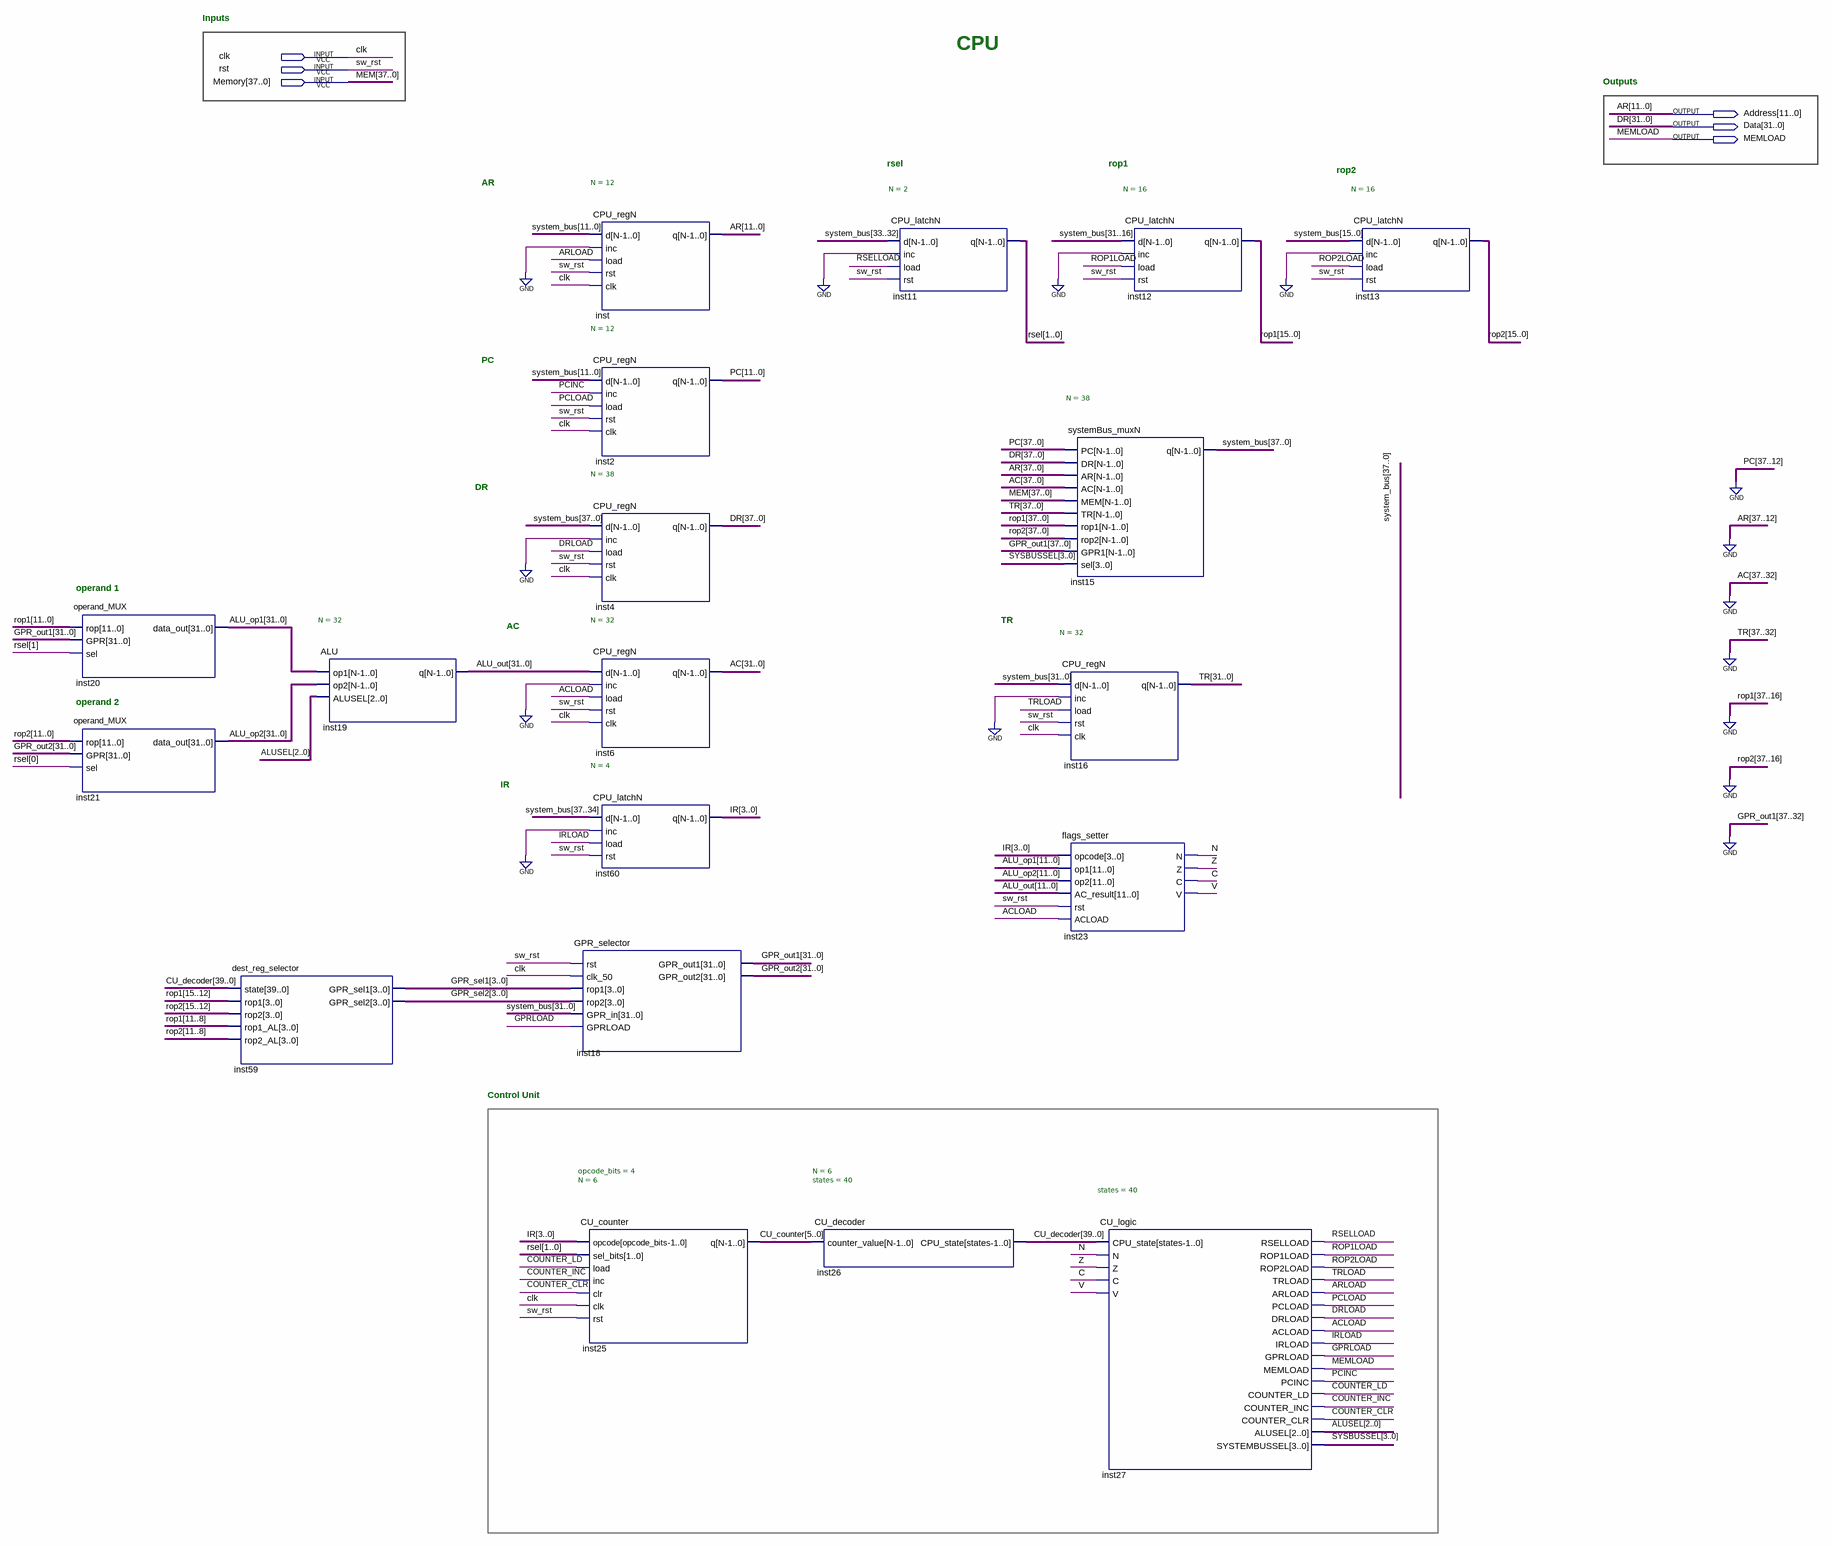
[diagram p0: schematic sheet]
// Quartus schematic CPU.bdf as structural Verilog: 19 symbols, 6 pins
module CPU (
  input  clk,
  input  rst,
  input  [37:0] Memory,
  output [11:0] Address,
  output [31:0] Data,
  output MEMLOAD
);

  wire ACLOAD, ARLOAD, C, COUNTER_CLR, COUNTER_INC, COUNTER_LD, DRLOAD, GPRLOAD, IRLOAD, N, PCINC, PCLOAD,
       ROP1LOAD, ROP2LOAD, RSELLOAD, TRLOAD, V, Z;
  wire [1:0] rsel;
  wire [2:0] ALUSEL;
  wire [3:0] GPR_sel1, GPR_sel2, IR, SYSBUSSEL;
  wire [5:0] CU_counter;
  wire [11:0] PC;
  wire [15:0] rop1, rop2;
  wire [31:0] AC, ALU_op1, ALU_op2, ALU_out, GPR_out1, GPR_out2, TR;
  wire [37:0] system_bus;
  wire [37:32] DR;
  wire [39:0] CU_decoder;

  operand_MUX inst20 (.rop(rop1[11:0]), .GPR(GPR_out1), .sel(rsel[1]), .data_out(ALU_op1));
  operand_MUX inst21 (.rop(rop2[11:0]), .GPR(GPR_out2), .sel(rsel[0]), .data_out(ALU_op2));
  dest_reg_selector inst59 (
    .state(CU_decoder), .rop1(rop1[15:12]), .rop2(rop2[15:12]), .rop1_AL(rop1[11:8]), .rop2_AL(rop2[11:8]),
    .GPR_sel1(GPR_sel1), .GPR_sel2(GPR_sel2));
  ALU #(.N(32)) inst19 (.op1(ALU_op1), .op2(ALU_op2), .ALUSEL(ALUSEL), .q(ALU_out));
  GPR_selector inst18 (
    .rst(rst), .clk_50(clk), .rop1(GPR_sel1), .rop2(GPR_sel2), .GPR_in(system_bus[31:0]), .GPRLOAD(GPRLOAD),
    .GPR_out1(GPR_out1), .GPR_out2(GPR_out2));
  CPU_regN #(.N(12)) inst (.d(system_bus[11:0]), .inc(1'b0), .load(ARLOAD), .rst(rst), .clk(clk), .q(Address));
  CPU_regN #(.N(12)) inst2 (.d(system_bus[11:0]), .inc(PCINC), .load(PCLOAD), .rst(rst), .clk(clk), .q(PC));
  CPU_regN #(.N(38)) inst4 (.d(system_bus), .inc(1'b0), .load(DRLOAD), .rst(rst), .clk(clk), .q({DR, Data}));
  CPU_regN #(.N(32)) inst6 (.d(ALU_out), .inc(1'b0), .load(ACLOAD), .rst(rst), .clk(clk), .q(AC));
  CPU_latchN #(.N(4)) inst60 (.d(system_bus[37:34]), .inc(1'b0), .load(IRLOAD), .rst(rst), .q(IR));
  CU_counter #(.opcode_bits(4), .N(6)) inst25 (
    .opcode(IR), .sel_bits(rsel), .load(COUNTER_LD), .inc(COUNTER_INC), .clr(COUNTER_CLR), .clk(clk),
    .rst(rst), .q(CU_counter));
  CU_decoder #(.N(6), .states(40)) inst26 (.counter_value(CU_counter), .CPU_state(CU_decoder));
  CPU_latchN #(.N(2)) inst11 (.d(system_bus[33:32]), .inc(1'b0), .load(RSELLOAD), .rst(rst), .q(rsel));
  systemBus_muxN #(.N(38)) inst15 (
    .PC({{26{1'b0}}, PC}), .DR({DR, Data}), .AR({{26{1'b0}}, Address}), .AC({{6{1'b0}}, AC}), .MEM(Memory),
    .TR({{6{1'b0}}, TR}), .rop1({{22{1'b0}}, rop1}), .rop2({{22{1'b0}}, rop2}), .GPR1({{6{1'b0}}, GPR_out1}),
    .sel(SYSBUSSEL), .q(system_bus));
  CPU_regN #(.N(32)) inst16 (.d(system_bus[31:0]), .inc(1'b0), .load(TRLOAD), .rst(rst), .clk(clk), .q(TR));
  flags_setter inst23 (
    .opcode(IR), .op1(ALU_op1[11:0]), .op2(ALU_op2[11:0]), .AC_result(ALU_out[11:0]), .rst(rst),
    .ACLOAD(ACLOAD), .N(N), .Z(Z), .C(C), .V(V));
  CPU_latchN #(.N(16)) inst12 (.d(system_bus[31:16]), .inc(1'b0), .load(ROP1LOAD), .rst(rst), .q(rop1));
  CU_logic #(.states(40)) inst27 (
    .CPU_state(CU_decoder), .N(N), .Z(Z), .C(C), .V(V), .RSELLOAD(RSELLOAD), .ROP1LOAD(ROP1LOAD),
    .ROP2LOAD(ROP2LOAD), .TRLOAD(TRLOAD), .ARLOAD(ARLOAD), .PCLOAD(PCLOAD), .DRLOAD(DRLOAD), .ACLOAD(ACLOAD),
    .IRLOAD(IRLOAD), .GPRLOAD(GPRLOAD), .MEMLOAD(MEMLOAD), .PCINC(PCINC), .COUNTER_LD(COUNTER_LD),
    .COUNTER_INC(COUNTER_INC), .COUNTER_CLR(COUNTER_CLR), .ALUSEL(ALUSEL), .SYSTEMBUSSEL(SYSBUSSEL));
  CPU_latchN #(.N(16)) inst13 (.d(system_bus[15:0]), .inc(1'b0), .load(ROP2LOAD), .rst(rst), .q(rop2));

  // Other names for the same wires on the sheet: AR[11:0] = Address; DR[31:0] = Data; MEM[37:0] = Memory;
  //   sw_rst = rst

  // Notes on the sheet:
  //   Inputs
  //   CPU
  //   Outputs
  //   rsel
  //   rop1
  //   rop2
  //   AR
  //   PC
  //   DR
  //   operand 1
  //   TR
  //   AC
  //   operand 2
  //   IR
  //   Control Unit
endmodule
